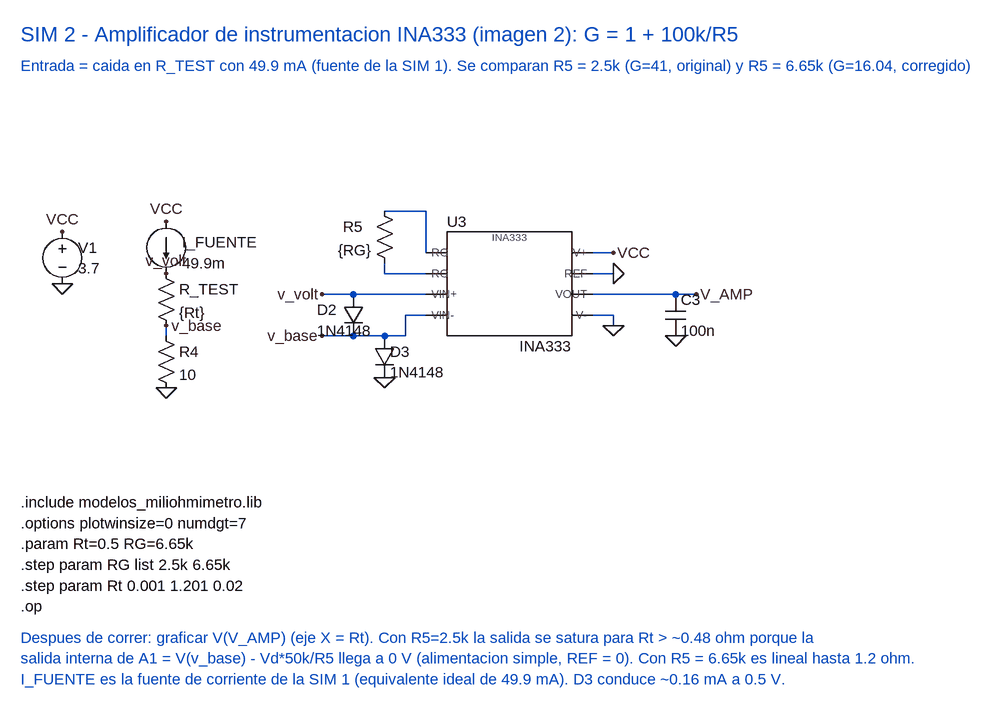
[diagram p0: schematic Sim2_INA333.asc]
Sim2_INA333.asc, the LTspice schematic file:
Version 4
SHEET 1 2400 1800
WIRE -336 48 -336 64
WIRE -96 0 64 0
WIRE -96 64 32 64
WIRE 32 64 32 32
WIRE 32 32 64 32
WIRE 0 -128 64 -128
WIRE 64 -128 64 -64
WIRE 0 -48 0 -32
WIRE 0 -32 64 -32
WIRE 320 -64 352 -64
WIRE 320 -32 352 -32
WIRE 320 32 352 32
WIRE 352 32 352 48
WIRE 320 0 480 0
FLAG -496 -96 VCC
FLAG -496 -16 0
FLAG -336 -112 VCC
FLAG -336 -32 v_volt
FLAG -336 144 0
FLAG -336 48 v_base
FLAG -96 0 v_volt
FLAG -96 64 v_base
FLAG 0 128 0
FLAG 352 -64 VCC
FLAG 352 -32 0
FLAG 352 48 0
FLAG 480 0 V_AMP
FLAG 448 64 0
SYMBOL voltage -496 -112 R0
WINDOW 0 24 40 Left 2
WINDOW 3 24 72 Left 2
SYMATTR InstName V1
SYMATTR Value 3.7
SYMBOL current -336 -112 R0
WINDOW 0 24 32 Left 2
WINDOW 3 24 64 Left 2
SYMATTR InstName I_FUENTE
SYMATTR Value 49.9m
SYMBOL res -352 -48 R0
WINDOW 0 36 40 Left 2
WINDOW 3 36 76 Left 2
SYMATTR InstName R_TEST
SYMATTR Value {Rt}
SYMBOL res -352 48 R0
WINDOW 0 36 40 Left 2
WINDOW 3 36 76 Left 2
SYMATTR InstName R4
SYMATTR Value 10
SYMBOL INA333 192 0 R0
WINDOW 0 -96 -112 Left 2
WINDOW 3 96 80 Right 2
SYMATTR InstName U3
SYMATTR Value INA333
SYMBOL diode -64 0 R0
WINDOW 0 -40 24 Left 2
WINDOW 3 -40 56 Left 2
SYMATTR InstName D2
SYMATTR Value 1N4148
SYMBOL diode -16 64 R0
WINDOW 0 24 24 Left 2
WINDOW 3 24 56 Left 2
SYMATTR InstName D3
SYMATTR Value 1N4148
SYMBOL res -16 -144 R0
WINDOW 0 -48 40 Left 2
WINDOW 3 -56 76 Left 2
SYMATTR InstName R5
SYMATTR Value {RG}
SYMBOL cap 432 0 R0
WINDOW 0 24 8 Left 2
WINDOW 3 24 56 Left 2
SYMATTR InstName C3
SYMATTR Value 100n
TEXT -560 -400 Left 3 ;SIM 2 - Amplificador de instrumentacion INA333 (imagen 2): G = 1 + 100k/R5
TEXT -560 -352 Left 2 ;Entrada = caida en R_TEST con 49.9 mA (fuente de la SIM 1). Se comparan R5 = 2.5k (G=41, original) y R5 = 6.65k (G=16.04, corregido)
TEXT -560 320 Left 2 !.include modelos_miliohmimetro.lib
TEXT -560 352 Left 2 !.options plotwinsize=0 numdgt=7
TEXT -560 384 Left 2 !.param Rt=0.5 RG=6.65k
TEXT -560 416 Left 2 !.step param RG list 2.5k 6.65k
TEXT -560 448 Left 2 !.step param Rt 0.001 1.201 0.02
TEXT -560 480 Left 2 !.op
TEXT -560 528 Left 2 ;Despues de correr: graficar V(V_AMP) (eje X = Rt). Con R5=2.5k la salida se satura para Rt > ~0.48 ohm porque la
TEXT -560 560 Left 2 ;salida interna de A1 = V(v_base) - Vd*50k/R5 llega a 0 V (alimentacion simple, REF = 0). Con R5 = 6.65k es lineal hasta 1.2 ohm.
TEXT -560 592 Left 2 ;I_FUENTE es la fuente de corriente de la SIM 1 (equivalente ideal de 49.9 mA). D3 conduce ~0.16 mA a 0.5 V.

The netlist it stands for:
* Sim2_INA333.asc
V1 VCC 0 3.7
I_FUENTE VCC v_volt 49.9m
R_TEST v_volt v_base {Rt}
R4 v_base 0 10
XU3 N002 v_base v_volt 0 0 V_AMP VCC N001 INA333  ; pins RG VIN- VIN+ V- REF VOUT V+ RG
D2 v_volt v_base 1N4148
D3 v_base 0 1N4148
R5 N001 N002 {RG}
C3 V_AMP 0 100n
.model D D
.lib standard.dio
* SIM 2 - Amplificador de instrumentacion INA333 (imagen 2): G = 1 + 100k/R5
* Entrada = caida en R_TEST con 49.9 mA (fuente de la SIM 1). Se comparan R5 = 2.5k (G=41, original) y R5 = 6.65k (G=16.04, corregido)
.include modelos_miliohmimetro.lib
.options plotwinsize=0 numdgt=7
.param Rt=0.5 RG=6.65k
.step param RG list 2.5k 6.65k
.step param Rt 0.001 1.201 0.02
.op
* Despues de correr: graficar V(V_AMP) (eje X = Rt). Con R5=2.5k la salida se satura para Rt > ~0.48 ohm porque la
* salida interna de A1 = V(v_base) - Vd*50k/R5 llega a 0 V (alimentacion simple, REF = 0). Con R5 = 6.65k es lineal hasta 1.2 ohm.
* I_FUENTE es la fuente de corriente de la SIM 1 (equivalente ideal de 49.9 mA). D3 conduce ~0.16 mA a 0.5 V.
.backanno
.end